# EAGLE design sign (EAGLE 7.5.0)
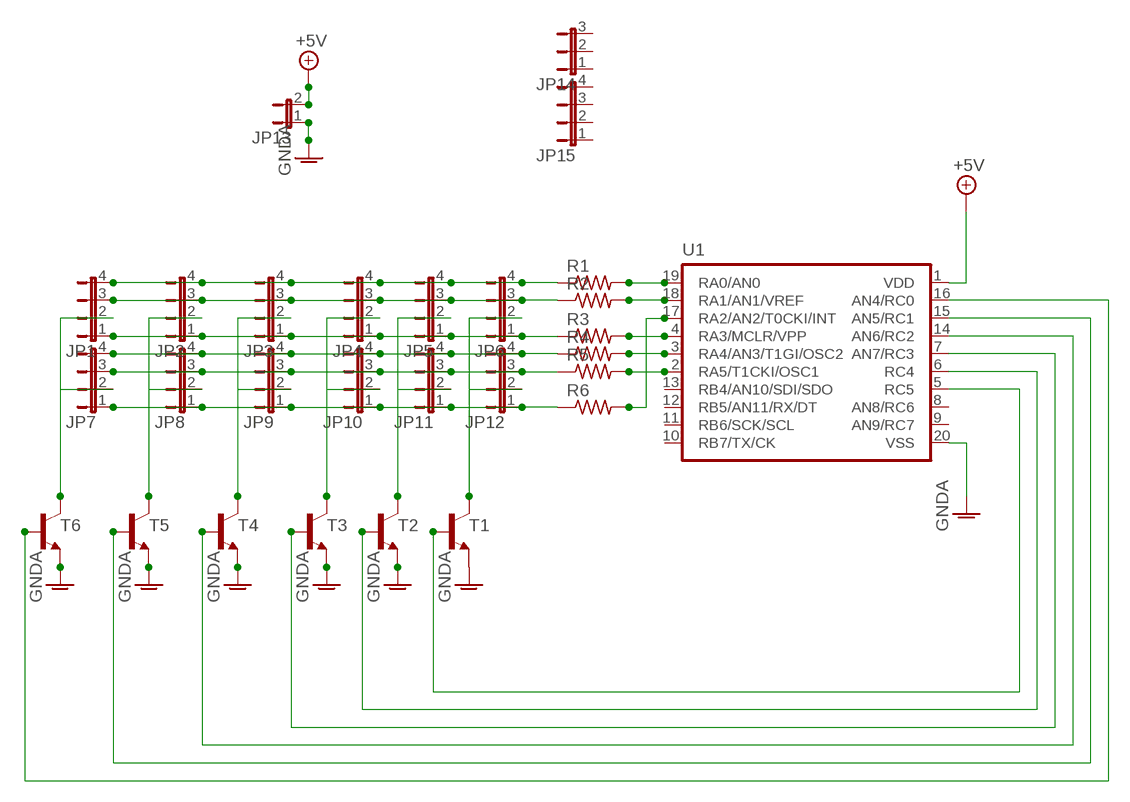
[diagram p0: schematic, sheet 1]

## Parts
JP1  JP4E  [JP4]
JP2  JP4E  [JP4]
JP3  JP4E  [JP4]
JP4  JP4E  [JP4]
JP5  JP4E  [JP4]
JP6  JP4E  [JP4]
JP7  JP4E  [JP4]
JP8  JP4E  [JP4]
JP9  JP4E  [JP4]
JP10  JP4E  [JP4]
JP11  JP4E  [JP4]
JP12  JP4E  [JP4]
JP13  JP1E  [JP1]
JP14  JP2E  [JP2]
JP15  JP4E  [JP4]
R1  R-US_0207/10  [0207/10]
R2  R-US_0207/10  [0207/10]
R3  R-US_0207/10  [0207/10]
R4  R-US_0207/10  [0207/10]
R5  R-US_0207/10  [0207/10]
R6  R-US_0207/10  [0207/10]
T1  -NPN-TO92  [TO92]
T2  -NPN-TO92  [TO92]
T3  -NPN-TO92  [TO92]
T4  -NPN-TO92  [TO92]
T5  -NPN-TO92  [TO92]
T6  -NPN-TO92  [TO92]
U1  PIC16F6XX  [DIL20]

## Nets
+5V: JP13.2 U1.1(VDD)
GNDA: JP13.1 T1.1(E) T2.1(E) T3.1(E) T4.1(E) T5.1(E) T6.1(E) U1.20(VSS)
N$1: R1.2 U1.19(RA0/AN0)
N$2: R2.2 U1.18(RA1/AN1/VREF)
N$3: R3.2 U1.4(RA3/MCLR/VPP)
N$4: R4.2 U1.3(RA4/AN3/T1GI/OSC2)
N$5: R5.2 U1.2(RA5/T1CKI/OSC1)
N$6: R6.2 U1.17(RA2/AN2/T0CKI/INT)
N$7: JP1.4 JP2.4 JP3.4 JP4.4 JP5.4 JP6.4 R1.1
N$8: JP1.2 JP7.2 T6.3(C)
N$9: JP2.2 JP8.2 T5.3(C)
N$10: JP3.2 JP9.2 T4.3(C)
N$11: JP4.2 JP10.2 T3.3(C)
N$12: JP5.2 JP11.2 T2.3(C)
N$13: JP1.3 JP2.3 JP3.3 JP4.3 JP5.3 JP6.3 R2.1
N$14: JP1.1 JP2.1 JP3.1 JP4.1 JP5.1 JP6.1 R3.1
N$15: JP7.4 JP8.4 JP9.4 JP10.4 JP11.4 JP12.4 R4.1
N$16: JP7.3 JP8.3 JP9.3 JP10.3 JP11.3 JP12.3 R5.1
N$17: JP6.2 JP12.2 T1.3(C)
N$18: JP7.1 JP8.1 JP9.1 JP10.1 JP11.1 JP12.1 R6.1
N$19: T6.2(B) U1.16(AN4/RC0)
N$20: T5.2(B) U1.15(AN5/RC1)
N$21: T4.2(B) U1.14(AN6/RC2)
N$22: T3.2(B) U1.7(AN7/RC3)
N$23: T2.2(B) U1.6(RC4)
N$24: T1.2(B) U1.5(RC5)
Unconnected: JP14.1 JP14.2 JP14.3 JP15.1 JP15.2 JP15.3 JP15.4 U1.8(AN8/RC6) U1.9(AN9/RC7) U1.10(RB7/TX/CK) U1.11(RB6/SCK/SCL) U1.12(RB5/AN11/RX/DT) U1.13(RB4/AN10/SDI/SDO)

## Library data of the parts
JP1-JP12 JP15 = jumper:JP4E: JUMPER
JP13 = jumper:JP1E: JUMPER
JP14 = jumper:JP2E: JUMPER
R1-R6 = rcl:R-US_: RESISTOR, American symbol
T1-T6 = transistor:*-NPN-: NPN Transistror BF959 corrected 2008.03.06
U1 = pic16f690:PIC16F6XX

## Board
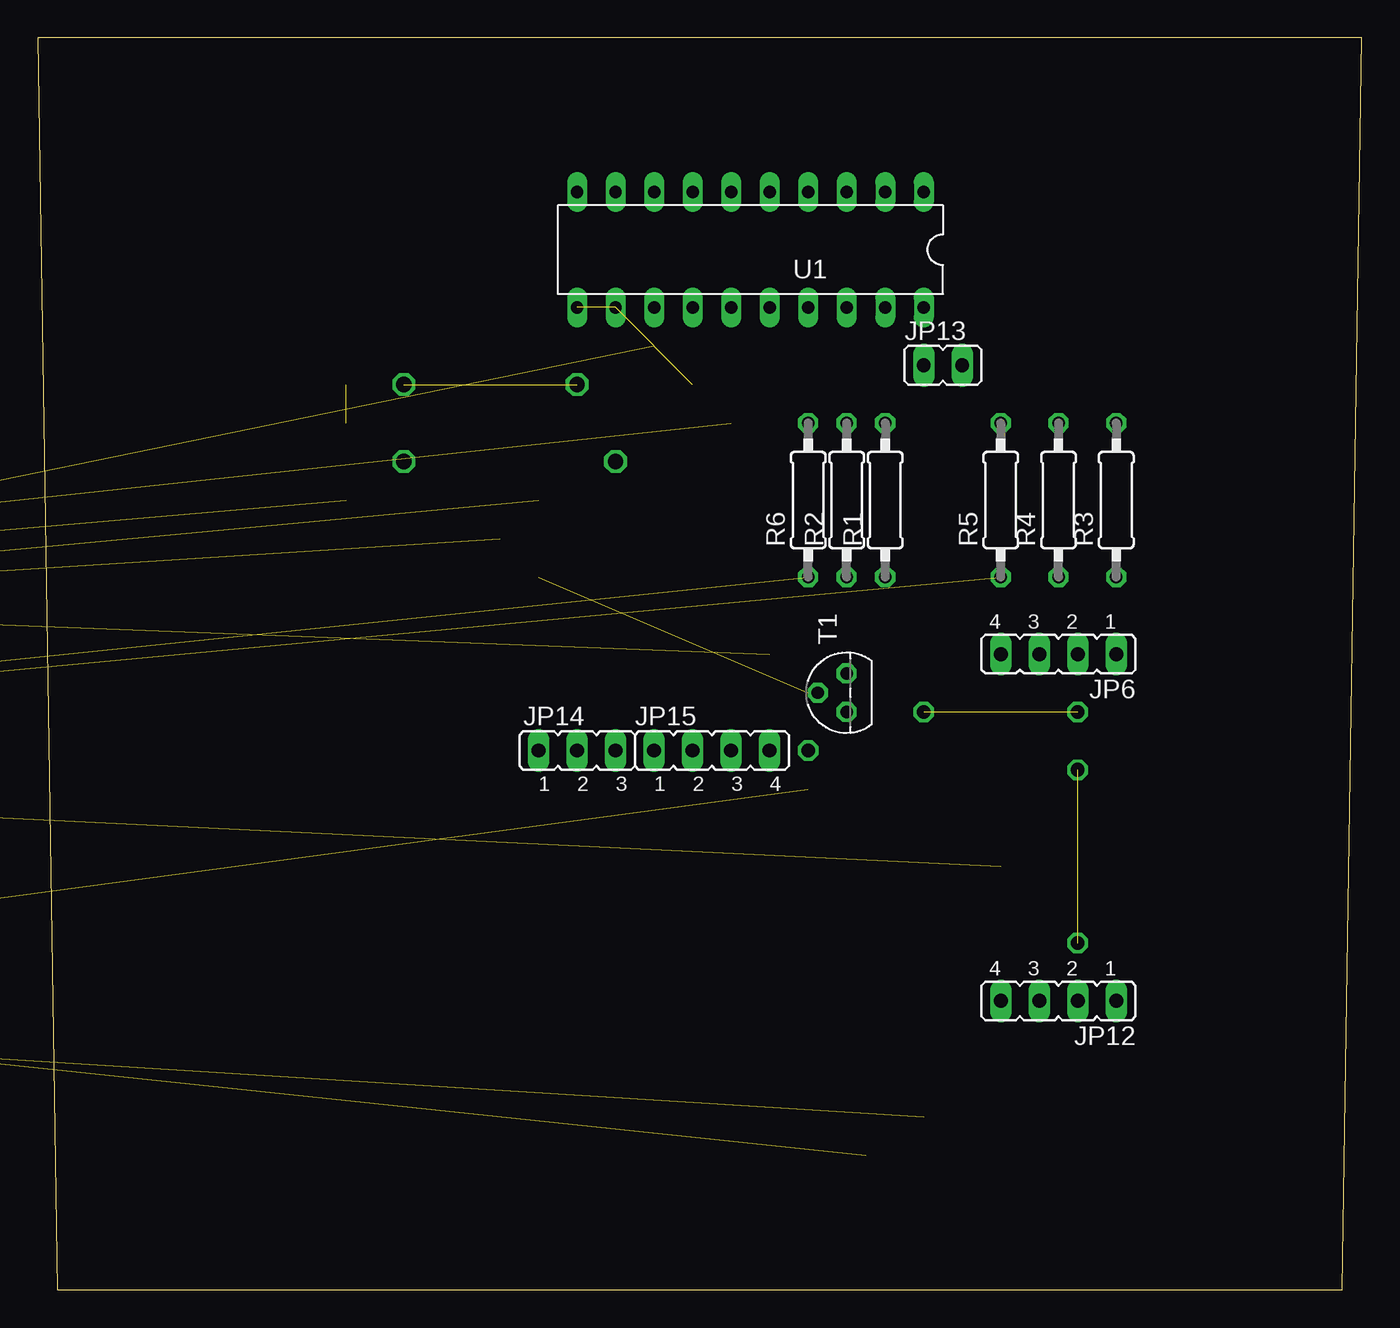
[diagram p1: board, top side]
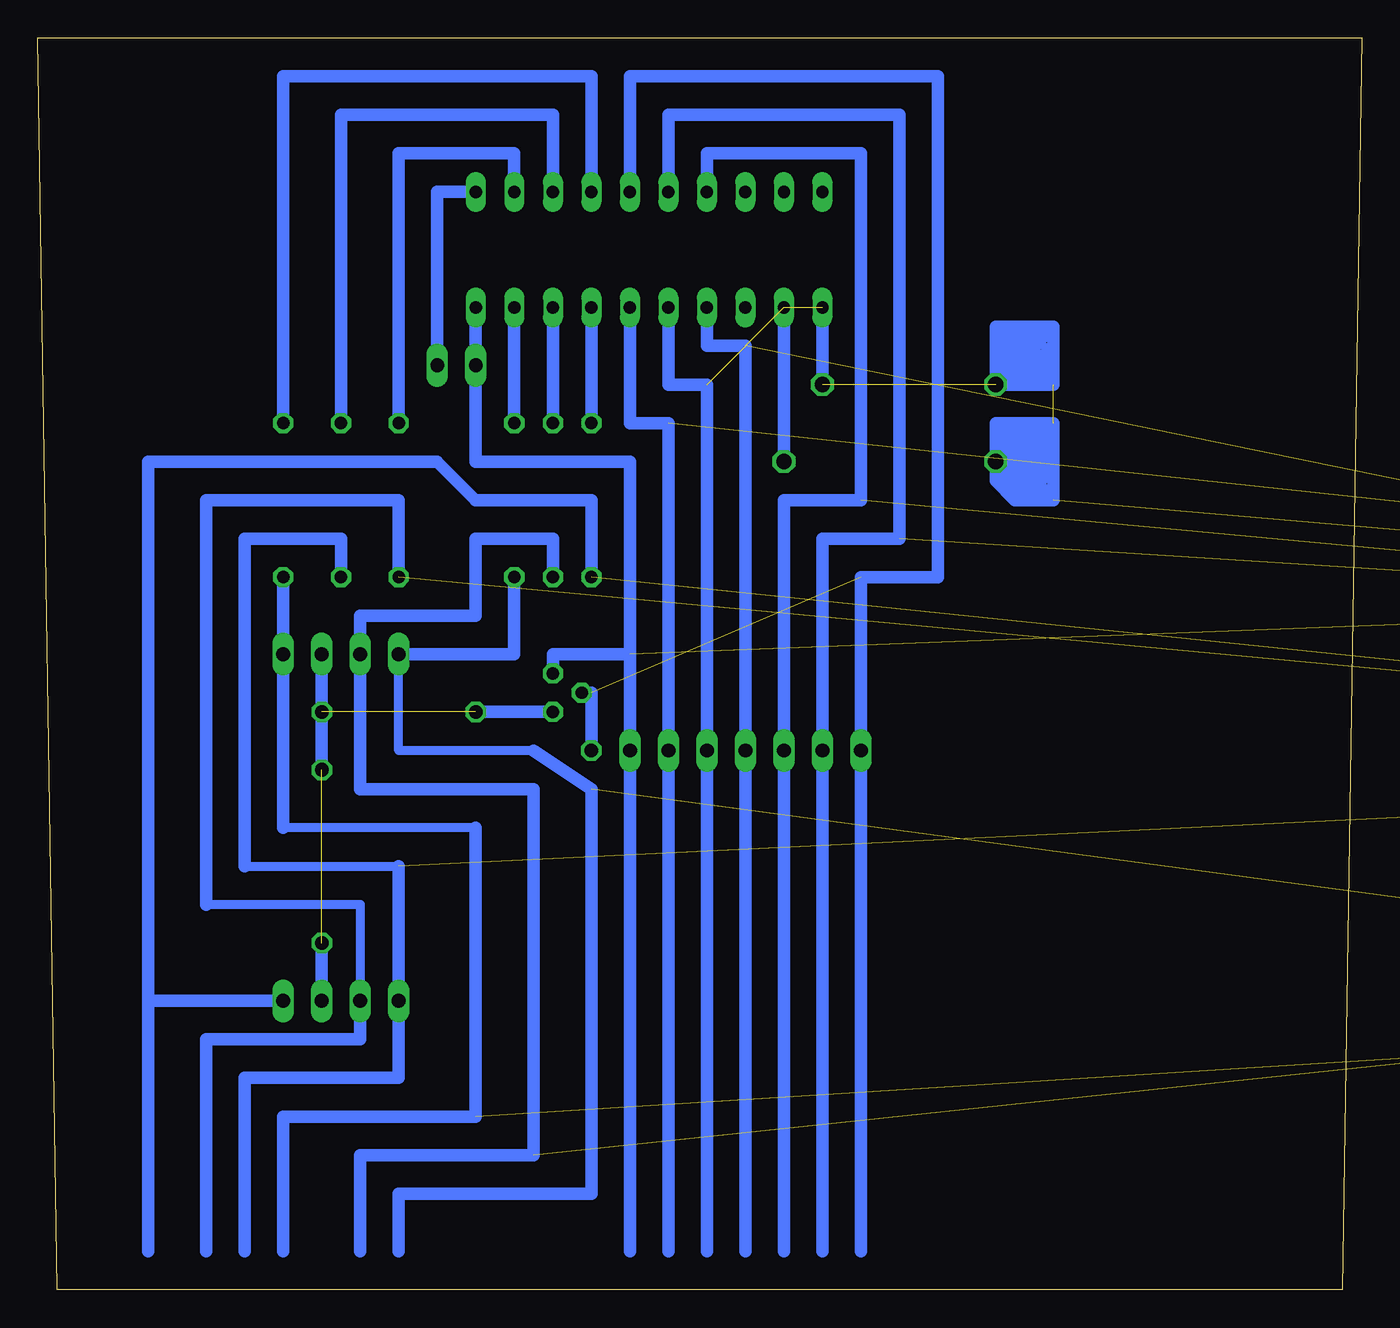
[diagram p2: board, bottom side, seen from below]

Size 87.3 x 82.54 mm. Coordinates in mm from the lower left corner, seen from the top.
Outline: 1.27,0 86.03,0 87.3,82.54 0,82.54 1.27,0
Copper layers (1*16): Top 0.035mm / dielectric 1.5mm / Bottom 0.035mm
Design rules "default": minimum track width 10mil, minimum drill 24mil, track to track 8mil, track to pad 8mil, pad to pad 8mil, via to via 8mil, smd to smd 8mil, copper to edge 40mil, drill to drill 8mil, minimum pad ring 10mil, minimum via ring 8mil, stop-mask expansion 4mil, vias tented up to drill 0mil, thermal gap 10mil

### Footprints (pad centres in the part's own frame; a part is rotated, then mirrored left to right if it is on the bottom)
JP4 = drill 0.914 long: 1 -3.81,0; 2 -1.27,0; 3 1.27,0; 4 3.81,0
JP1 = drill 0.914 long: 1 0,-1.27; 2 0,1.27
JP2 = drill 0.914 long: 1 -2.54,0; 2 0,0; 3 2.54,0
0207/10 = drill 0.813 octagon: 1 -5.08,0; 2 5.08,0
TO92 = drill 0.813 octagon: 1 1.27,0; 2 0,1.905; 3 -1.27,0
DIL20 = drill 0.813 long: 1 -11.43,-3.81; 2 -8.89,-3.81; 3 -6.35,-3.81; 4 -3.81,-3.81; 5 -1.27,-3.81; 6 1.27,-3.81; 7 3.81,-3.81; 8 6.35,-3.81; 9 8.89,-3.81; 10 11.43,-3.81; 11 11.43,3.81; 12 8.89,3.81; 13 6.35,3.81; 14 3.81,3.81; 15 1.27,3.81; 16 -1.27,3.81; 17 -3.81,3.81; 18 -6.35,3.81; 19 -8.89,3.81; 20 -11.43,3.81

### Placement (x,y rotation side)
JP1  -45.72,3.81 0 top  (outside the outline)
JP2  -19.05,16.51 0 top  (outside the outline)
JP3  -30.48,16.51 0 top  (outside the outline)
JP4  -41.91,16.51 0 top  (outside the outline)
JP5  -19.05,24.13 0 top  (outside the outline)
JP6  67.31,41.91 180 top
JP7  -41.91,24.13 0 top  (outside the outline)
JP8  -19.05,31.75 0 top  (outside the outline)
JP9  -30.48,31.75 0 top  (outside the outline)
JP10  -41.91,31.75 0 top  (outside the outline)
JP11  -19.05,39.37 0 top  (outside the outline)
JP12  67.31,19.05 180 top
JP13  59.69,60.96 270 top
JP14  35.56,35.56 0 top
JP15  44.45,35.56 0 top
R1  55.88,52.07 90 top
R2  53.34,52.07 90 top
R3  71.12,52.07 90 top
R4  67.31,52.07 90 top
R5  63.5,52.07 90 top
R6  50.8,52.07 90 top
T1  53.34,39.37 90 top
T2  -19.05,44.45 0 top  (outside the outline)
T3  -27.94,44.45 0 top  (outside the outline)
T4  -36.83,44.45 0 top  (outside the outline)
T5  -45.72,44.45 0 top  (outside the outline)
T6  -54.61,44.45 0 top  (outside the outline)
U1  46.99,68.58 180 top

### Tracks (layer width: path | path; a pad name or v marks a point on that pad's centre or on a via)
+5V
  Bottom 0.813: U1.1 60.96,72.39 JP13.2
GNDA  (5 unrouted)
  Bottom 0.813: U1.20 JP13.1 58.42,54.61 48.26,54.61 48.26,41.91 | 48.26,2.54 48.26,41.91 | T1.1 53.34,41.91 48.26,41.91
N$1
  Bottom 0.813: R1.2 U1.19
N$2
  Bottom 0.813: R2.2 U1.18
N$3
  Bottom 0.813: U1.4 50.8,80.01 71.12,80.01 R3.2
N$4
  Bottom 0.813: U1.3 53.34,77.47 67.31,77.47 R4.2
N$5
  Bottom 0.813: U1.2 55.88,74.93 63.5,74.93 R5.2
N$6
  Bottom 0.813: R6.2 U1.17
N$7  (5 unrouted)
  Bottom 0.61: 54.61,35.56 63.5,35.56 JP6.4
  Bottom 0.813: R1.1 55.88,41.91 JP6.4 | 63.5,2.54 63.5,6.35 50.8,6.35 50.8,33.02 54.61,35.56
N$8  (2 unrouted)
N$9  (2 unrouted)
N$10  (2 unrouted)
N$11  (2 unrouted)
N$12  (2 unrouted)
N$13  (5 unrouted)
  Bottom 0.813: R2.1 53.34,49.53 58.42,49.53 58.42,44.45 66.04,44.45 JP6.3 66.04,33.02 54.61,33.02 54.61,8.89 66.04,8.89 66.04,2.54
N$14  (5 unrouted)
  Bottom 0.61: 58.42,30.48 71.12,30.48
  Bottom 0.813: 71.12,44.45 R3.1 JP6.1 71.12,30.48 | 71.12,2.54 71.12,11.43 58.42,11.43 58.42,30.48
N$15  (5 unrouted)
  Bottom 0.61: 73.66,27.94 63.5,27.94
  Bottom 0.813: R4.1 67.31,49.53 73.66,49.53 73.66,27.94 | 63.5,27.94 JP12.4 63.5,13.97 73.66,13.97 73.66,2.54
N$16  (5 unrouted)
  Bottom 0.61: JP12.3 66.04,25.4 76.2,25.4
  Bottom 0.813: R5.1 63.5,52.07 76.2,52.07 76.2,25.4 | 76.2,2.54 76.2,16.51 66.04,16.51 JP12.3
N$17  (via drill 0.9)  (2 unrouted)
  Bottom 0.813: JP12.2 v68.58,22.86 | 58.42,38.1 T1.3 | JP6.2 v68.58,34.29 v68.58,38.1 JP6.2
N$18  (5 unrouted)
  Bottom 0.813: 80.01,19.05 80.01,54.61 60.96,54.61 58.42,52.07 50.8,52.07 R6.1 | 80.01,19.05 80.01,2.54 | 80.01,19.05 JP12.1
N$19  (1 unrouted)
  Bottom 0.813: U1.16 48.26,57.15 45.72,57.15 45.72,2.54
N$20  (via drill 1)  (5 unrouted)
  Bottom 0.406: 24.13,59.69 22.86,62.23 | 24.13,60.96 22.86,60.96 22.86,62.23 | 22.86,62.23 20.32,62.23 21.59,59.69 21.59,63.5 | 24.13,55.88 22.86,57.15 | 22.86,57.15 21.59,55.88 20.32,57.15 | 21.59,57.15 22.86,55.88 22.86,57.15 | 22.86,59.69 24.13,62.23 22.86,62.23
  Bottom 0.813: U1.15 45.72,59.69 43.18,59.69 43.18,2.54 | 35.56,64.77 v35.56,59.69 | 38.1,64.77 v38.1,54.61 | 24.13,63.5 24.13,62.23 | 24.13,60.96 24.13,59.69 | 20.32,59.69 20.32,60.96 | 20.32,62.23 20.32,63.5 | 21.59,63.5 20.32,63.5 | 20.32,63.5 24.13,59.69 | 24.13,59.69 22.86,59.69 | 22.86,59.69 21.59,59.69 | 20.32,59.69 22.86,62.23 | 22.86,62.23 24.13,63.5 | 24.13,63.5 22.86,63.5 | 22.86,63.5 21.59,63.5 | 21.59,62.23 21.59,60.96 | 21.59,60.96 22.86,59.69 | 22.86,59.69 24.13,60.96 | 24.13,60.96 24.13,62.23 | 24.13,62.23 22.86,63.5 | 22.86,62.23 22.86,59.69 | 21.59,60.96 20.32,62.23 | 20.32,62.23 20.32,60.96 | 20.32,60.96 21.59,59.69 | 21.59,59.69 arc-90 24.13,62.23 | 24.13,62.23 21.59,59.69 | 21.59,59.69 21.59,60.96 | 21.59,62.23 22.86,62.23 | 22.86,62.23 22.86,63.5 | 20.32,59.69 21.59,59.69 | 21.59,62.23 21.59,63.5 | 21.59,63.5 22.86,62.23 | 20.32,54.61 21.59,54.61 22.86,54.61 | 20.32,54.61 20.32,55.88 | 20.32,55.88 20.32,57.15 21.59,57.15 | 24.13,55.88 24.13,57.15 | 24.13,54.61 24.13,53.34 | 24.13,53.34 22.86,52.07 | 20.32,52.07 20.32,54.61 | 20.32,55.88 21.59,55.88 21.59,57.15 | 24.13,55.88 22.86,55.88 24.13,57.15 | 24.13,55.88 22.86,54.61 | 22.86,53.34 21.59,53.34 | 24.13,54.61 22.86,54.61 | 22.86,54.61 21.59,53.34 | 22.86,53.34 24.13,53.34 | 24.13,54.61 24.13,55.88 | 21.59,52.07 21.59,53.34 | 22.86,53.34 22.86,52.07 | 22.86,52.07 21.59,52.07 | 21.59,53.34 20.32,52.07 | 20.32,52.07 21.59,52.07 | 21.59,52.07 22.86,53.34 | 24.13,57.15 22.86,57.15 21.59,57.15 | 21.59,57.15 20.32,55.88
  Bottom 1.676: 21.59,53.34 21.59,54.61 21.59,55.88 22.86,55.88 22.86,54.61 22.86,53.34
N$21  (1 unrouted)
  Bottom 0.813: 43.18,63.5 U1.14 43.18,62.23 40.64,62.23 40.64,8.89 40.64,2.54
N$22  (1 unrouted)
  Bottom 0.813: U1.7 43.18,74.93 33.02,74.93 33.02,52.07 38.1,52.07 38.1,46.99 38.1,44.45 38.1,2.54
N$23  (1 unrouted)
  Bottom 0.813: U1.6 45.72,77.47 30.48,77.47 30.48,49.53 35.56,49.53 35.56,2.54
N$24  (via drill 0.9)  (1 unrouted)
  Bottom 0.813: U1.5 48.26,80.01 27.94,80.01 27.94,46.99 33.02,46.99 33.02,2.54 | T1.2 50.8,39.37 v50.8,35.56
N$25  (via drill 0.9)
  other vias: 58.42,38.1
N$27  (via drill 1)
  other vias: 24.13,54.61
N$28  (via drill 1)
  other vias: 24.13,59.69